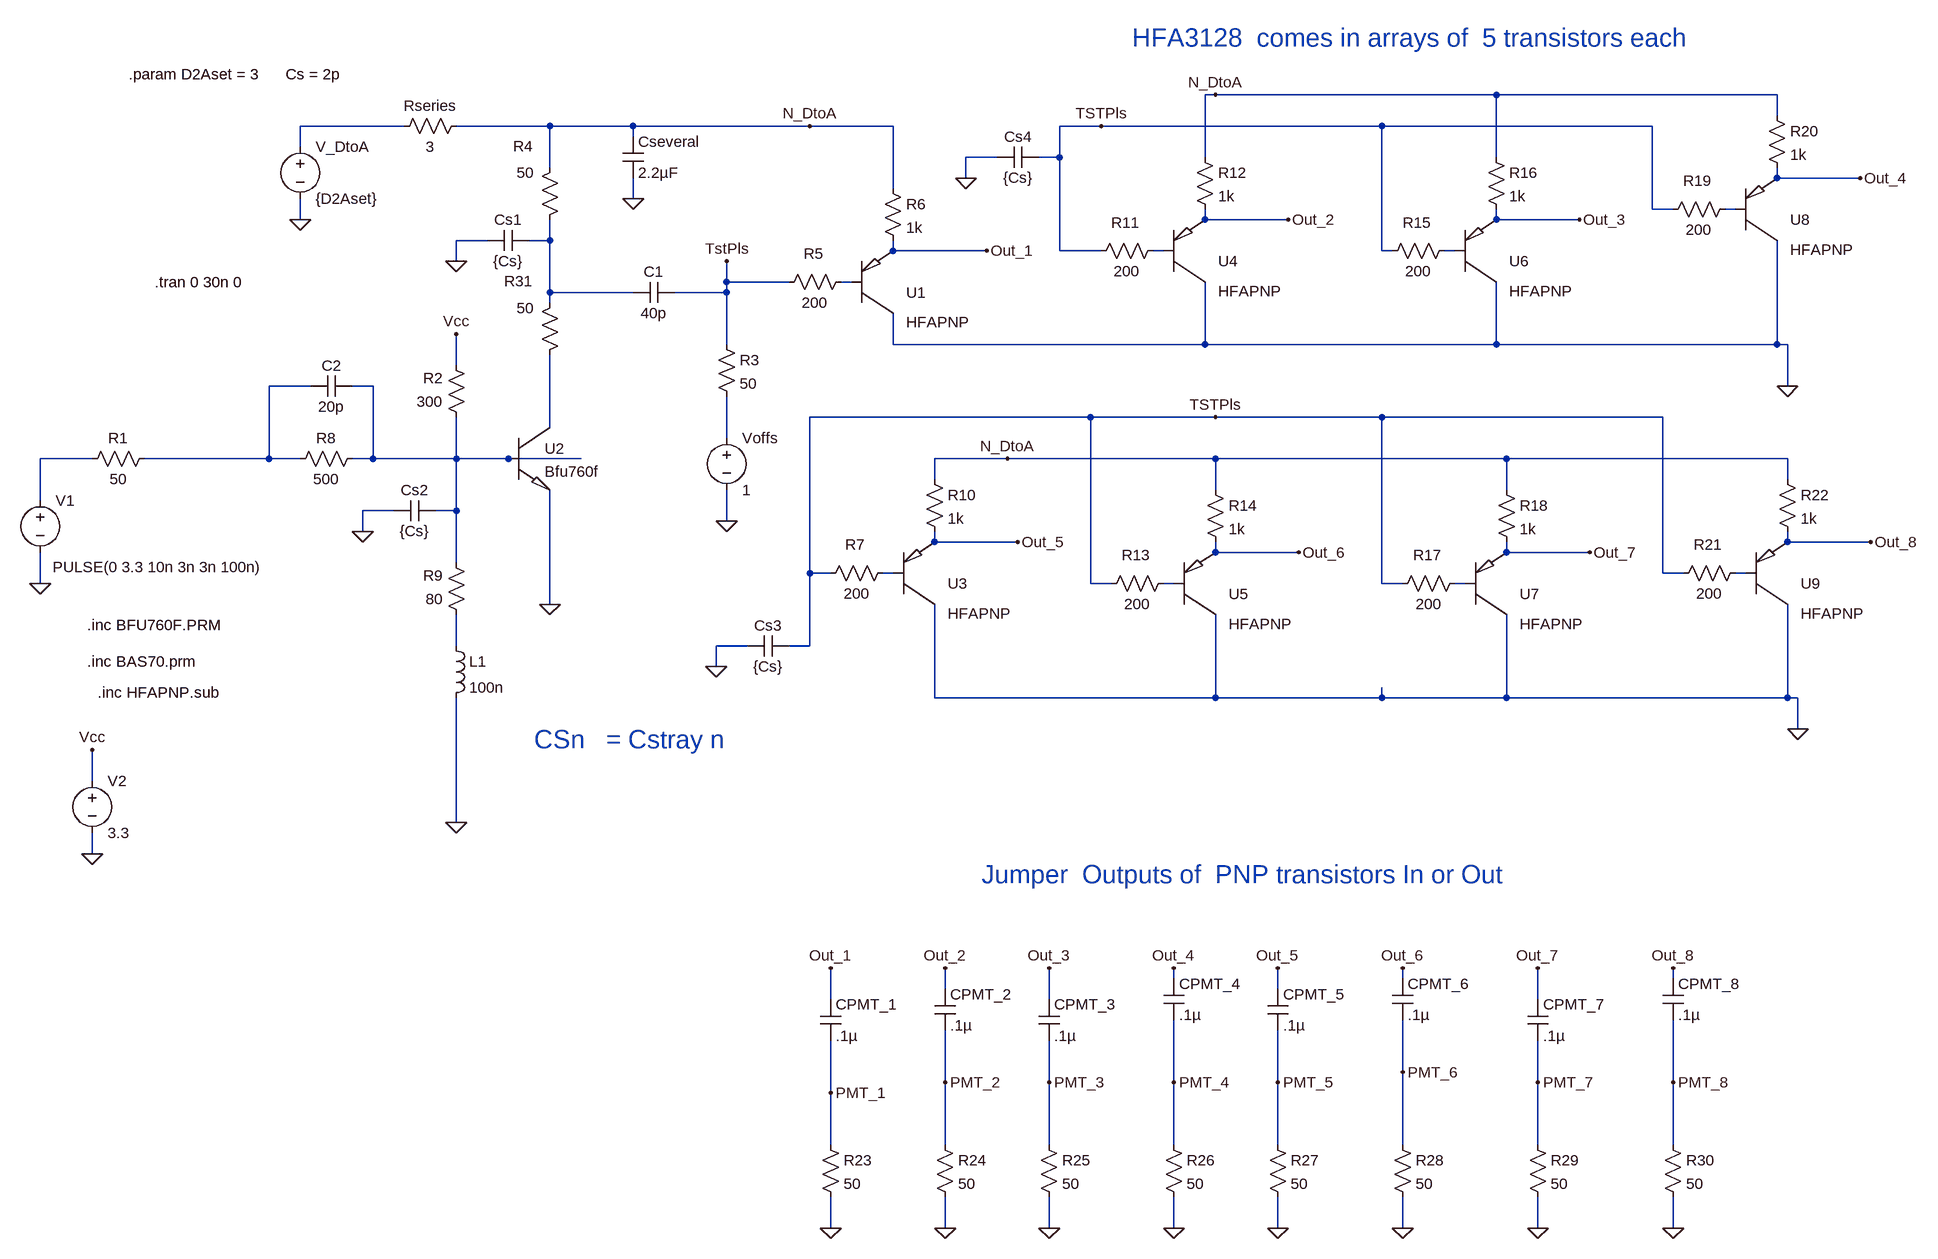
[diagram p0: schematic Simple_Pulser.asc]
Simple_Pulser.asc, the LTspice schematic file:
Version 4
SHEET 1 2524 1296
WIRE 1072 -480 1056 -480
WIRE 1504 -480 1072 -480
WIRE 1936 -480 1504 -480
WIRE 1936 -448 1936 -480
WIRE -176 -432 -336 -432
WIRE 48 -432 -96 -432
WIRE 176 -432 48 -432
WIRE 448 -432 176 -432
WIRE 576 -432 448 -432
WIRE 896 -432 832 -432
WIRE 1328 -432 896 -432
WIRE 1744 -432 1328 -432
WIRE 176 -416 176 -432
WIRE -336 -400 -336 -432
WIRE 736 -384 688 -384
WIRE 832 -384 832 -432
WIRE 832 -384 800 -384
WIRE 1056 -384 1056 -480
WIRE 1504 -384 1504 -480
WIRE 48 -368 48 -432
WIRE 688 -352 688 -384
WIRE 1936 -352 1936 -368
WIRE 2064 -352 1936 -352
WIRE 576 -336 576 -432
WIRE 176 -320 176 -352
WIRE 1744 -304 1744 -432
WIRE 1776 -304 1744 -304
WIRE 1872 -304 1856 -304
WIRE -336 -288 -336 -320
WIRE 1056 -288 1056 -304
WIRE 1184 -288 1056 -288
WIRE 1504 -288 1504 -304
WIRE 1632 -288 1504 -288
WIRE -48 -256 -96 -256
WIRE 48 -256 48 -288
WIRE 48 -256 16 -256
WIRE 576 -240 576 -256
WIRE 720 -240 576 -240
WIRE 832 -240 832 -384
WIRE 896 -240 832 -240
WIRE 992 -240 976 -240
WIRE 1328 -240 1328 -432
WIRE 1344 -240 1328 -240
WIRE 1440 -240 1424 -240
WIRE -96 -224 -96 -256
WIRE 320 -192 320 -224
WIRE 416 -192 320 -192
WIRE 512 -192 496 -192
WIRE 48 -176 48 -256
WIRE 176 -176 48 -176
WIRE 320 -176 320 -192
WIRE 320 -176 240 -176
WIRE 48 -160 48 -176
WIRE 320 -96 320 -176
WIRE 576 -96 576 -144
WIRE 1056 -96 1056 -192
WIRE 1056 -96 576 -96
WIRE 1504 -96 1504 -192
WIRE 1504 -96 1056 -96
WIRE 1936 -96 1936 -256
WIRE 1936 -96 1504 -96
WIRE 1952 -96 1936 -96
WIRE -96 -64 -96 -112
WIRE -320 -32 -384 -32
WIRE -224 -32 -256 -32
WIRE 1952 -32 1952 -96
WIRE 880 16 448 16
WIRE 1072 16 880 16
WIRE 1328 16 1072 16
WIRE 1760 16 1328 16
WIRE 48 32 48 -80
WIRE 320 48 320 -16
WIRE -656 80 -736 80
WIRE -384 80 -384 -32
WIRE -384 80 -576 80
WIRE -336 80 -384 80
WIRE -224 80 -224 -32
WIRE -224 80 -256 80
WIRE -96 80 -96 16
WIRE -96 80 -224 80
WIRE -16 80 -96 80
WIRE 96 80 -16 80
WIRE 752 80 640 80
WIRE 1072 80 752 80
WIRE 1520 80 1072 80
WIRE 1952 80 1520 80
WIRE 640 112 640 80
WIRE 1952 112 1952 80
WIRE 1072 128 1072 80
WIRE 1520 128 1520 80
WIRE -736 144 -736 80
WIRE -192 160 -240 160
WIRE -96 160 -96 80
WIRE -96 160 -128 160
WIRE 320 176 320 128
WIRE -240 192 -240 160
WIRE 640 208 640 192
WIRE 768 208 640 208
WIRE 1952 208 1952 192
WIRE 2080 208 1952 208
WIRE 1072 224 1072 208
WIRE 1200 224 1072 224
WIRE 1520 224 1520 208
WIRE 1648 224 1520 224
WIRE -96 240 -96 160
WIRE 448 256 448 16
WIRE 480 256 448 256
WIRE 576 256 560 256
WIRE 1760 256 1760 16
WIRE 1792 256 1760 256
WIRE 1888 256 1872 256
WIRE -736 272 -736 224
WIRE 880 272 880 16
WIRE 912 272 880 272
WIRE 1008 272 992 272
WIRE 1328 272 1328 16
WIRE 1360 272 1328 272
WIRE 1456 272 1440 272
WIRE 48 304 48 128
WIRE -96 368 -96 320
WIRE 352 368 304 368
WIRE 448 368 448 256
WIRE 448 368 416 368
WIRE 304 400 304 368
WIRE 640 448 640 304
WIRE 1072 448 1072 320
WIRE 1072 448 640 448
WIRE 1328 448 1328 432
WIRE 1328 448 1072 448
WIRE 1520 448 1520 320
WIRE 1520 448 1328 448
WIRE 1952 448 1952 304
WIRE 1952 448 1520 448
WIRE 1968 448 1952 448
WIRE 1968 496 1968 448
WIRE -656 576 -656 528
WIRE -96 640 -96 448
WIRE -656 688 -656 656
WIRE 1008 880 1008 864
WIRE 1360 880 1360 864
WIRE 1776 880 1776 864
WIRE 656 896 656 864
WIRE 1168 896 1168 864
WIRE 480 912 480 864
WIRE 816 912 816 864
WIRE 1568 912 1568 864
WIRE 1360 1024 1360 944
WIRE 656 1040 656 960
WIRE 816 1040 816 976
WIRE 1008 1040 1008 944
WIRE 1168 1040 1168 960
WIRE 1568 1040 1568 976
WIRE 1776 1040 1776 944
WIRE 480 1056 480 976
WIRE 480 1136 480 1056
WIRE 656 1136 656 1040
WIRE 816 1136 816 1040
WIRE 1008 1136 1008 1040
WIRE 1168 1136 1168 1040
WIRE 1360 1136 1360 1024
WIRE 1568 1136 1568 1040
WIRE 1776 1136 1776 1040
WIRE 480 1264 480 1216
WIRE 656 1264 656 1216
WIRE 816 1264 816 1216
WIRE 1008 1264 1008 1216
WIRE 1168 1264 1168 1216
WIRE 1360 1264 1360 1216
WIRE 1568 1264 1568 1216
WIRE 1776 1264 1776 1216
FLAG -736 272 0
FLAG -336 -288 0
FLAG -96 640 0
FLAG 48 304 0
FLAG -96 -112 Vcc
FLAG -656 688 0
FLAG -656 528 Vcc
FLAG -96 -224 0
FLAG 320 176 0
FLAG 1184 -288 Out_2
FLAG 1200 224 Out_6
FLAG 1632 -288 Out_3
FLAG 2064 -352 Out_4
FLAG 1648 224 Out_7
FLAG 2080 208 Out_8
FLAG 768 208 Out_5
FLAG 720 -240 Out_1
FLAG 320 -224 TstPls
FLAG 1072 16 TSTPls
FLAG 448 -432 N_DtoA
FLAG 1072 -480 N_DtoA
FLAG 752 80 N_DtoA
FLAG 896 -432 TSTPls
FLAG 480 1264 0
FLAG 480 864 Out_1
FLAG 656 1264 0
FLAG 816 1264 0
FLAG 1008 1264 0
FLAG 1168 1264 0
FLAG 1360 1264 0
FLAG 1568 1264 0
FLAG 1776 1264 0
FLAG 656 864 Out_2
FLAG 816 864 Out_3
FLAG 1008 864 Out_4
FLAG 1168 864 Out_5
FLAG 1360 864 Out_6
FLAG 1568 864 Out_7
FLAG 1776 864 Out_8
FLAG -240 192 0
FLAG 1952 -32 0
FLAG 1968 496 0
FLAG 304 400 0
FLAG 688 -352 0
FLAG 176 -320 0
FLAG 480 1056 PMT_1
FLAG 656 1040 PMT_2
FLAG 816 1040 PMT_3
FLAG 1008 1040 PMT_4
FLAG 1168 1040 PMT_5
FLAG 1360 1024 PMT_6
FLAG 1568 1040 PMT_7
FLAG 1776 1040 PMT_8
SYMBOL res -560 64 R90
WINDOW 0 0 56 VBottom 2
WINDOW 3 32 56 VTop 2
SYMATTR InstName R1
SYMATTR Value 50
SYMBOL xnpn -16 32 R0
SYMATTR InstName U2
SYMATTR Value Bfu760f
SYMBOL res 64 -384 M0
WINDOW 0 42 -17 Left 2
WINDOW 3 40 24 Left 2
SYMATTR InstName R4
SYMATTR Value 50
SYMBOL voltage -736 128 R0
WINDOW 3 19 119 Left 2
WINDOW 123 0 0 Left 2
WINDOW 39 0 0 Left 2
SYMATTR Value PULSE(0 3.3 10n 3n 3n 100n)
SYMATTR InstName V1
SYMBOL res -240 64 R90
WINDOW 0 0 56 VBottom 2
WINDOW 3 32 56 VTop 2
SYMATTR InstName R8
SYMATTR Value 500
SYMBOL res -80 336 R180
WINDOW 0 36 76 Left 2
WINDOW 3 36 40 Left 2
SYMATTR InstName R9
SYMATTR Value 80
SYMBOL ind -112 352 R0
SYMATTR InstName L1
SYMATTR Value 100n
SYMBOL cap -256 -48 R90
WINDOW 0 0 32 VBottom 2
WINDOW 3 32 32 VTop 2
SYMATTR InstName C2
SYMATTR Value 20p
SYMBOL res -80 32 R180
WINDOW 0 36 76 Left 2
WINDOW 3 36 40 Left 2
SYMATTR InstName R2
SYMATTR Value 300
SYMBOL voltage -656 560 R0
SYMATTR InstName V2
SYMATTR Value 3.3
SYMBOL cap 16 -272 R90
WINDOW 0 0 32 VBottom 2
WINDOW 3 32 32 VTop 2
SYMATTR InstName Cs1
SYMATTR Value {Cs}
SYMBOL voltage -336 -416 R0
SYMATTR InstName V_DtoA
SYMATTR Value {D2Aset}
SYMBOL cap 240 -192 R90
WINDOW 0 0 32 VBottom 2
WINDOW 3 32 32 VTop 2
SYMATTR InstName C1
SYMATTR Value 40p
SYMBOL res 304 -112 R0
SYMATTR InstName R3
SYMATTR Value 50
SYMBOL res 512 -208 R90
WINDOW 0 -12 58 VBottom 2
WINDOW 3 32 56 VTop 2
SYMATTR InstName R5
SYMATTR Value 200
SYMBOL res 560 -352 R0
SYMATTR InstName R6
SYMATTR Value 1k
SYMBOL xpnp 512 -144 M180
WINDOW 3 84 -14 Left 2
SYMATTR InstName U1
SYMATTR Value HFAPNP
SYMBOL voltage 320 32 R0
SYMATTR InstName Voffs
SYMATTR Value 1
SYMBOL res 576 240 R90
WINDOW 0 -12 58 VBottom 2
WINDOW 3 32 56 VTop 2
SYMATTR InstName R7
SYMATTR Value 200
SYMBOL res 624 96 R0
SYMATTR InstName R10
SYMATTR Value 1k
SYMBOL xpnp 576 304 M180
WINDOW 3 84 -14 Left 2
SYMATTR InstName U3
SYMATTR Value HFAPNP
SYMBOL res 992 -256 R90
WINDOW 0 -12 58 VBottom 2
WINDOW 3 32 56 VTop 2
SYMATTR InstName R11
SYMATTR Value 200
SYMBOL res 1040 -400 R0
SYMATTR InstName R12
SYMATTR Value 1k
SYMBOL xpnp 992 -192 M180
WINDOW 3 84 -14 Left 2
SYMATTR InstName U4
SYMATTR Value HFAPNP
SYMBOL res 1008 256 R90
WINDOW 0 -12 58 VBottom 2
WINDOW 3 32 56 VTop 2
SYMATTR InstName R13
SYMATTR Value 200
SYMBOL res 1056 112 R0
SYMATTR InstName R14
SYMATTR Value 1k
SYMBOL xpnp 1008 320 M180
WINDOW 3 84 -14 Left 2
SYMATTR InstName U5
SYMATTR Value HFAPNP
SYMBOL res 1440 -256 R90
WINDOW 0 -12 58 VBottom 2
WINDOW 3 32 56 VTop 2
SYMATTR InstName R15
SYMATTR Value 200
SYMBOL res 1488 -400 R0
SYMATTR InstName R16
SYMATTR Value 1k
SYMBOL xpnp 1440 -192 M180
WINDOW 3 84 -14 Left 2
SYMATTR InstName U6
SYMATTR Value HFAPNP
SYMBOL res 1456 256 R90
WINDOW 0 -12 58 VBottom 2
WINDOW 3 32 56 VTop 2
SYMATTR InstName R17
SYMATTR Value 200
SYMBOL res 1504 112 R0
SYMATTR InstName R18
SYMATTR Value 1k
SYMBOL xpnp 1456 320 M180
WINDOW 3 84 -14 Left 2
SYMATTR InstName U7
SYMATTR Value HFAPNP
SYMBOL res 1872 -320 R90
WINDOW 0 -12 58 VBottom 2
WINDOW 3 32 56 VTop 2
SYMATTR InstName R19
SYMATTR Value 200
SYMBOL res 1920 -464 R0
SYMATTR InstName R20
SYMATTR Value 1k
SYMBOL xpnp 1872 -256 M180
WINDOW 3 84 -14 Left 2
SYMATTR InstName U8
SYMATTR Value HFAPNP
SYMBOL res 1888 240 R90
WINDOW 0 -12 58 VBottom 2
WINDOW 3 32 56 VTop 2
SYMATTR InstName R21
SYMATTR Value 200
SYMBOL res 1936 96 R0
SYMATTR InstName R22
SYMATTR Value 1k
SYMBOL xpnp 1888 304 M180
WINDOW 3 84 -14 Left 2
SYMATTR InstName U9
SYMATTR Value HFAPNP
SYMBOL res 464 1120 R0
SYMATTR InstName R23
SYMATTR Value 50
SYMBOL res 640 1120 R0
SYMATTR InstName R24
SYMATTR Value 50
SYMBOL res 800 1120 R0
SYMATTR InstName R25
SYMATTR Value 50
SYMBOL res 992 1120 R0
SYMATTR InstName R26
SYMATTR Value 50
SYMBOL res 1152 1120 R0
SYMATTR InstName R27
SYMATTR Value 50
SYMBOL res 1344 1120 R0
SYMATTR InstName R28
SYMATTR Value 50
SYMBOL res 1552 1120 R0
SYMATTR InstName R29
SYMATTR Value 50
SYMBOL res 1760 1120 R0
SYMATTR InstName R30
SYMATTR Value 50
SYMBOL cap 464 912 R0
SYMATTR InstName CPMT_1
SYMATTR Value .1µ
SYMBOL cap 640 896 R0
SYMATTR InstName CPMT_2
SYMATTR Value .1µ
SYMBOL cap 800 912 R0
SYMATTR InstName CPMT_3
SYMATTR Value .1µ
SYMBOL cap 992 880 R0
SYMATTR InstName CPMT_4
SYMATTR Value .1µ
SYMBOL cap 1152 896 R0
SYMATTR InstName CPMT_5
SYMATTR Value .1µ
SYMBOL cap 1344 880 R0
SYMATTR InstName CPMT_6
SYMATTR Value .1µ
SYMBOL cap 1552 912 R0
SYMATTR InstName CPMT_7
SYMATTR Value .1µ
SYMBOL cap 1760 880 R0
SYMATTR InstName CPMT_8
SYMATTR Value .1µ
SYMBOL res 64 -176 M0
WINDOW 0 42 -17 Left 2
WINDOW 3 40 24 Left 2
SYMATTR InstName R31
SYMATTR Value 50
SYMBOL cap -128 144 R90
WINDOW 0 0 32 VBottom 2
WINDOW 3 32 32 VTop 2
SYMATTR InstName Cs2
SYMATTR Value {Cs}
SYMBOL cap 416 352 R90
WINDOW 0 0 32 VBottom 2
WINDOW 3 32 32 VTop 2
SYMATTR InstName Cs3
SYMATTR Value {Cs}
SYMBOL cap 800 -400 R90
WINDOW 0 0 32 VBottom 2
WINDOW 3 32 32 VTop 2
SYMATTR InstName Cs4
SYMATTR Value {Cs}
SYMBOL cap 160 -416 R0
SYMATTR InstName Cseveral
SYMATTR Value 2.2µF
SYMBOL res -80 -448 R90
WINDOW 0 0 56 VBottom 2
WINDOW 3 32 56 VTop 2
SYMATTR InstName Rseries
SYMATTR Value 3
TEXT -664 336 Left 2 !.inc BFU760F.PRM
TEXT -560 -192 Left 2 !.tran 0 30n 0
TEXT -664 392 Left 2 !.inc BAS70.prm
TEXT -600 -512 Left 2 !.param D2Aset = 3      Cs = 2p
TEXT -648 440 Left 2 !.inc HFAPNP.sub
TEXT 712 720 Left 4 ;Jumper  Outputs of  PNP transistors In or Out
TEXT 944 -568 Left 4 ;HFA3128  comes in arrays of  5 transistors each
TEXT 24 512 Left 4 ;CSn   = Cstray n

The netlist it stands for:
* Simple_Pulser.asc
R1 N007 N011 50
XU2 N009 N008 0 Bfu760f  ; pins C B E
R4 N_DtoA N003 50
V1 N011 0 PULSE(0 3.3 10n 3n 3n 100n)
R8 N008 N007 500
R9 N016 N008 80
L1 N016 0 100n
C2 N008 N007 20p
R2 N008 Vcc 300
V2 Vcc 0 3.3
Cs1 N003 0 {Cs}
V_DtoA N001 0 {D2Aset}
C1 TstPls N003 40p
R3 TstPls N010 50
R5 N006 TstPls 200
R6 N_DtoA Out_1 1k
XU1 0 N006 Out_1 HFAPNP  ; pins C B E
Voffs N010 0 1
R7 N012 TstPls 200
R10 N_DtoA Out_5 1k
XU3 0 N012 Out_5 HFAPNP  ; pins C B E
R11 N004 TstPls 200
R12 N_DtoA Out_2 1k
XU4 0 N004 Out_2 HFAPNP  ; pins C B E
R13 N014 TstPls 200
R14 N_DtoA Out_6 1k
XU5 0 N014 Out_6 HFAPNP  ; pins C B E
R15 N005 TstPls 200
R16 N_DtoA Out_3 1k
XU6 0 N005 Out_3 HFAPNP  ; pins C B E
R17 N015 TstPls 200
R18 N_DtoA Out_7 1k
XU7 0 N015 Out_7 HFAPNP  ; pins C B E
R19 N002 TstPls 200
R20 N_DtoA Out_4 1k
XU8 0 N002 Out_4 HFAPNP  ; pins C B E
R21 N013 TstPls 200
R22 N_DtoA Out_8 1k
XU9 0 N013 Out_8 HFAPNP  ; pins C B E
R23 PMT_1 0 50
R24 PMT_2 0 50
R25 PMT_3 0 50
R26 PMT_4 0 50
R27 PMT_5 0 50
R28 PMT_6 0 50
R29 PMT_7 0 50
R30 PMT_8 0 50
CPMT_1 Out_1 PMT_1 .1µ
CPMT_2 Out_2 PMT_2 .1µ
CPMT_3 Out_3 PMT_3 .1µ
CPMT_4 Out_4 PMT_4 .1µ
CPMT_5 Out_5 PMT_5 .1µ
CPMT_6 Out_6 PMT_6 .1µ
CPMT_7 Out_7 PMT_7 .1µ
CPMT_8 Out_8 PMT_8 .1µ
R31 N003 N009 50
Cs2 N008 0 {Cs}
Cs3 TstPls 0 {Cs}
Cs4 TstPls 0 {Cs}
Cseveral N_DtoA 0 2.2µF
Rseries N_DtoA N001 3
.inc BFU760F.PRM
.tran 0 30n 0
.inc BAS70.prm
.param D2Aset = 3      Cs = 2p
.inc HFAPNP.sub
* Jumper  Outputs of  PNP transistors In or Out
* HFA3128  comes in arrays of  5 transistors each
* CSn   = Cstray n
.backanno
.end